# Altium project spb_sample_project.PrjPcb
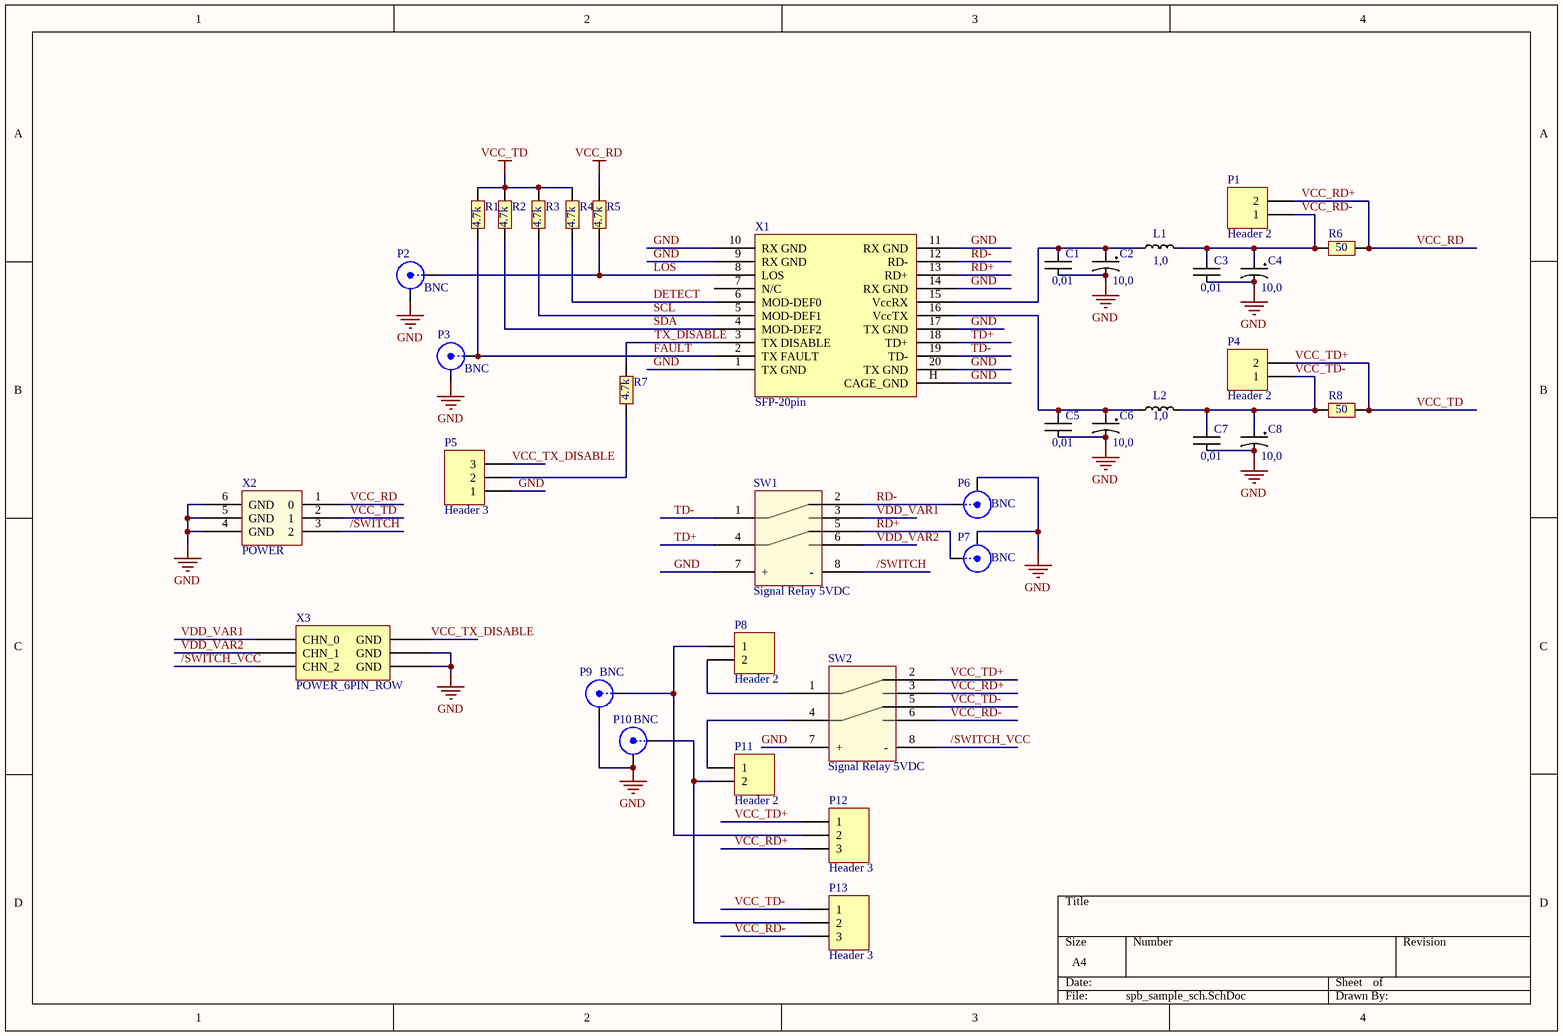
[diagram p0: spb_sample_sch.SchDoc]
1 sheet, 36 parts. Net scope: global (net labels, ports and power ports of the same name join across sheets).
Board file: spb_sample_pcb.PcbDoc

## Sheet spb_sample_sch.SchDoc
size A4

### Parts
C1  0,01  [0805]
C2  10,0  [TYPE_C]
C3  0,01  [0805]
C4  10,0  [TYPE_C]
C5  0,01  [0805]
C6  10,0  [TYPE_C]
C7  0,01  [0805]
C8  10,0  [TYPE_C]
L1  1,0  [0805]
L2  1,0  [0805]
P1  Header 2  [HDR1X2]
P2  BNC  [BNC_RA CON]
P3  BNC  [BNC_RA CON]
P4  Header 2  [HDR1X2]
P5  Header 3  [HDR1X3]
P6  BNC  [BNC_RA CON]
P7  BNC  [BNC_RA CON]
P8  Header 2  [HDR1X2]
P9  BNC  [BNC_RA CON]
P10  BNC  [BNC_RA CON]
P11  Header 2  [HDR1X2]
P12  Header 3  [HDR1X3]
P13  Header 3  [HDR1X3]
R1  4.7k  [0805]
R2  4.7k  [0805]
R3  4.7k  [0805]
R4  4.7k  [0805]
R5  4.7k  [0805]
R6  50  [0805]
R7  4.7k  [0805]
R8  50  [0805]
SW1  Signal Relay 5VDC  [V23079 Relay]
SW2  Signal Relay 5VDC  [V23079 Relay]
X1  SFP-20pin  [SFP-20pin]
X2  POWER  [POWER]
X3  POWER_6PIN_ROW  [POWER_6PIN_ROW]

### Nets
GND: C1.2 C2.1 C3.2 C4.1 C5.2 C6.1 C7.2 C8.1 P2.2(Y) P3.2(Y) P5.1 P6.2(Y) P7.2(Y) P9.2(Y) P10.2(Y) SW1.7(+) SW2.7(+) X1.1(TX_GND) X1.9(RX_GND) X1.10(RX_GND) X1.11(RX_GND) X1.14(RX_GND) X1.17(TX_GND) X1.20(TX_GND) X1.H(CAGE_GND) X2.4(GND) X2.5(GND) X2.6(GND) X3.4(GND) X3.5(GND)
VCC_RD: P1.2 P12.3 R5.1 R6.2 SW2.3(-) X2.1(0)  [also labelled VCC_RD+]
VCC_TD: P4.2 P12.1 R1.1 R2.1 R3.1 R4.1 R8.2 SW2.2(-) X2.2(1)  [also labelled VCC_TD+]
/SWITCH: SW1.8(-) X2.3(2)
/SWITCH_VCC: SW2.8(-) X3.6(CHN_2)
DETECT: R4.2 X1.6(MOD-DEF0)
FAULT: P3.1(X) R1.2 X1.2(TX_FAULT)
LOS: P2.1(X) R5.2 X1.8(LOS)
RD+: P7.1(X) SW1.5(-) X1.13(RD+)
RD-: P6.1(X) SW1.2(-) X1.12(RD-)
SCL: R3.2 X1.5(MOD-DEF1)
SDA: R2.2 X1.4(MOD-DEF2)
TD+: SW1.4(-) X1.18(TD+)
TD-: SW1.1(-) X1.19(TD-)
TX_DISABLE: R7.1 X1.3(TX_DISABLE)
VCC_RD-: C3.1 C4.2 L1.2 P1.1 P13.3 R6.1 SW2.6(-)
VCC_TD-: C7.1 C8.2 L2.2 P4.1 P13.1 R8.1 SW2.5(-)
VCC_TX_DISABLE: P5.3 X3.2(GND)
VDD_VAR1: SW1.3(-) X3.1(CHN_0)
VDD_VAR2: SW1.6(-) X3.3(CHN_1)
NetC1_1: C1.1 C2.2 L1.1 X1.15(VccRX)
NetC5_1: C5.1 C6.2 L2.1 X1.16(VccTX)
NetP5_2: P5.2 R7.2
NetP8_1: P8.1 P9.1(X) P12.2
NetP8_2: P8.2 SW2.1(-)
NetP10_1: P10.1(X) P11.2 P13.2
NetP11_1: P11.1 SW2.4(-)

Not connected (* = marked no-connect by the designer): X1 7(N/C)

### Library data of the parts
C1 C3 C5 C7 = CAP_SMALL: 0805
C2 C4 C6 C8 = CAP_TANT: SMD
L1 L2 = INDUCT: 0805
P1 P4 P8 P11 = Header 2: Header, 2-Pin; LatestRevisionDate: 17-Jul-2002; LatestRevisionNote: Re-released for DXP Platform.; Publisher: Altium Limited
P2 P3 P6 P7 P9 P10 = BNC: BNC Elbow Connector; LatestRevisionDate: 17-Jul-2002; LatestRevisionNote: Re-released for DXP Platform.; Publisher: Altium Limited
P5 P12 P13 = Header 3: Header, 3-Pin; LatestRevisionDate: 17-Jul-2002; LatestRevisionNote: Re-released for DXP Platform.; Publisher: Altium Limited
R1-R8 = RES0805: 0805
SW1 SW2 = SWITCH